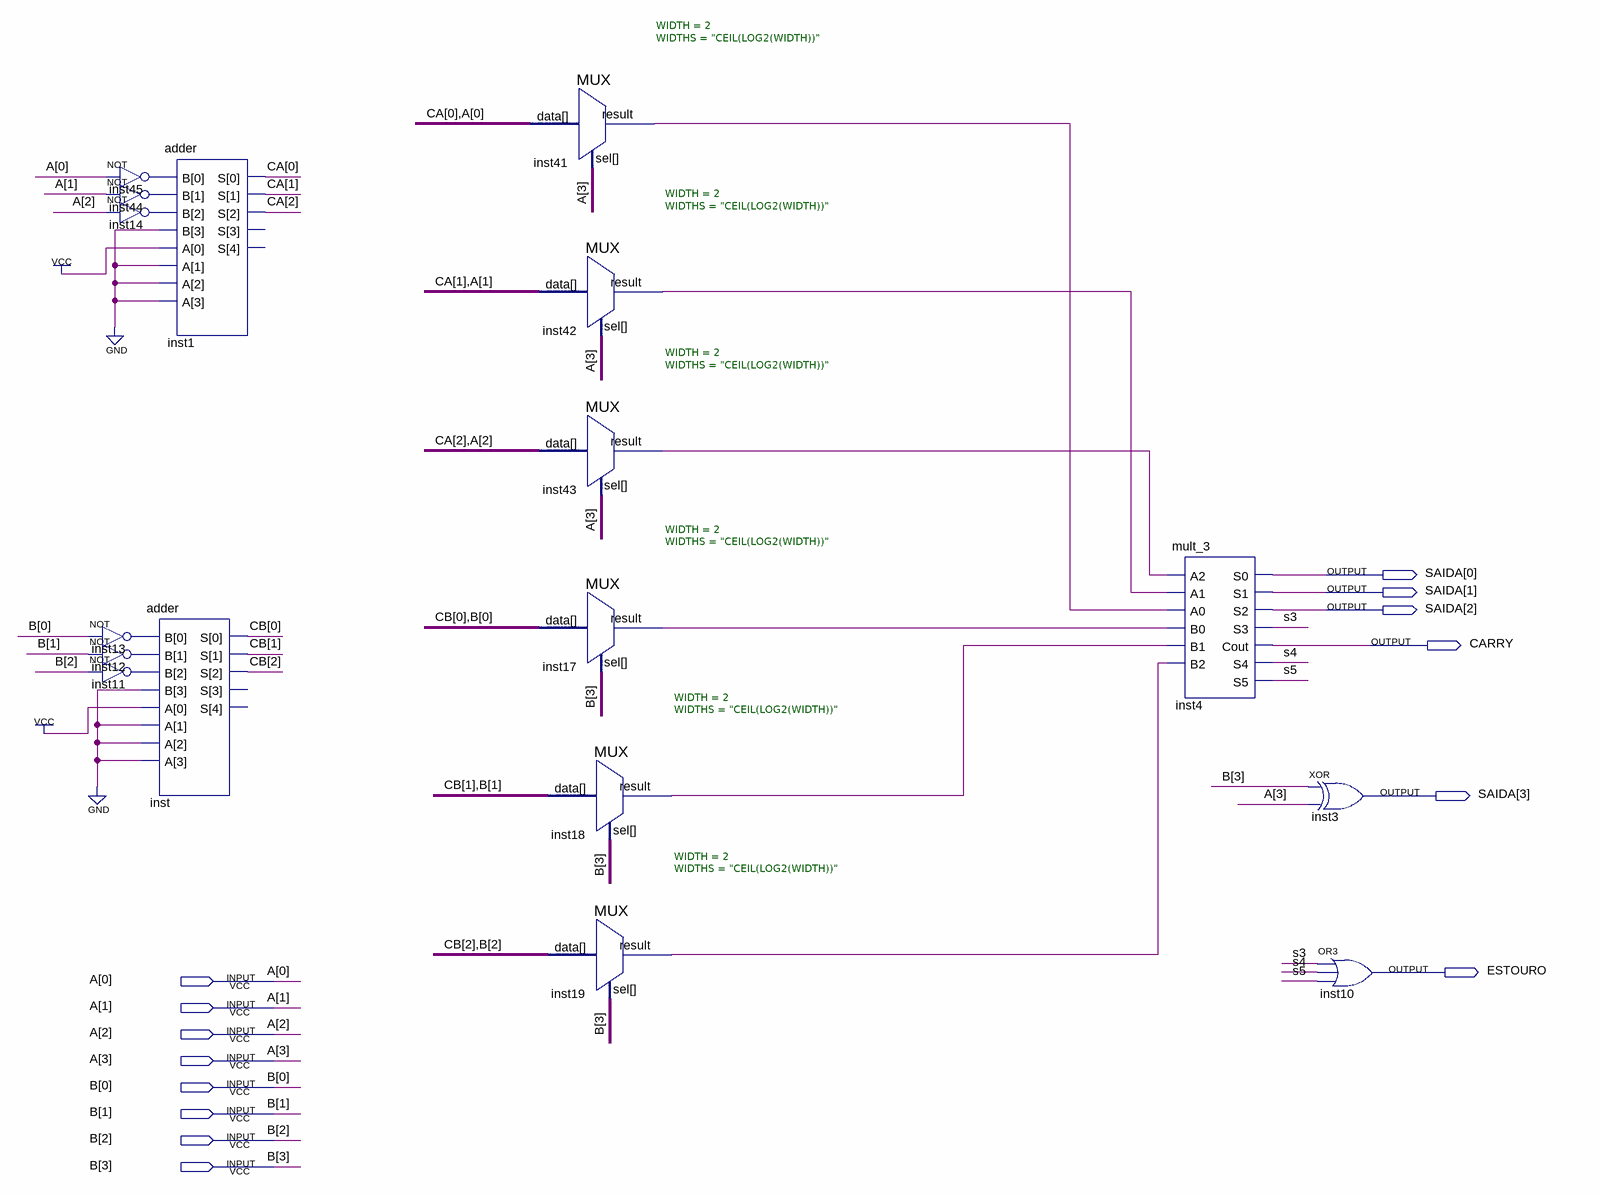
[diagram p0: schematic sheet]
// Quartus schematic multiplicador_C2.bdf as structural Verilog: 17 symbols, 14 pins
module multiplicador_C2 (
  input  [3:0] A,
  input  [3:0] B,
  output [3:0] SAIDA,
  output CARRY,
  output ESTOURO
);

  wire inst11_out, inst12_out, inst13_out, inst14_out, inst17_result, inst18_result, inst19_result,
       inst41_result, inst42_result, inst43_result, inst44_out, inst45_out, s3, s4, s5;
  wire [2:0] CA, CB;
  wire [4:0] inst_s_open;  // unused outputs
  wire [4:0] inst1_s_open;  // unused outputs

  not inst45 (inst45_out, A[0]);
  not inst44 (inst44_out, A[1]);
  not inst14 (inst14_out, A[2]);
  not inst13 (inst13_out, B[0]);
  not inst12 (inst12_out, B[1]);
  not inst11 (inst11_out, B[2]);
  adder inst1 (.B({1'b0, inst14_out, inst44_out, inst45_out}), .A(4'b0001), .S({inst1_s_open[4:3], CA}));
  adder inst (.B({1'b0, inst11_out, inst12_out, inst13_out}), .A(4'b0001), .S({inst_s_open[4:3], CB}));
  MUX #(.WIDTH(2), .WIDTHS("CEIL(LOG2(WIDTH))")) inst41 (.data({CA[0], A[0]}), .sel(A[3]), .result(inst41_result));
  MUX #(.WIDTH(2), .WIDTHS("CEIL(LOG2(WIDTH))")) inst42 (.data({CA[1], A[1]}), .sel(A[3]), .result(inst42_result));
  MUX #(.WIDTH(2), .WIDTHS("CEIL(LOG2(WIDTH))")) inst43 (.data({CA[2], A[2]}), .sel(A[3]), .result(inst43_result));
  MUX #(.WIDTH(2), .WIDTHS("CEIL(LOG2(WIDTH))")) inst17 (.data({CB[0], B[0]}), .sel(B[3]), .result(inst17_result));
  MUX #(.WIDTH(2), .WIDTHS("CEIL(LOG2(WIDTH))")) inst18 (.data({CB[1], B[1]}), .sel(B[3]), .result(inst18_result));
  MUX #(.WIDTH(2), .WIDTHS("CEIL(LOG2(WIDTH))")) inst19 (.data({CB[2], B[2]}), .sel(B[3]), .result(inst19_result));
  mult_3 inst4 (
    .A2(inst43_result), .A1(inst42_result), .A0(inst41_result), .B0(inst17_result), .B1(inst18_result),
    .B2(inst19_result), .S0(SAIDA[0]), .S1(SAIDA[1]), .S2(SAIDA[2]), .S3(s3), .Cout(CARRY), .S4(s4), .S5(s5));
  xor inst3 (SAIDA[3], B[3], A[3]);
  or inst10 (ESTOURO, s3, s4, s5);
endmodule
